# Altium schematic sheet ut_basketball_robot_mainboard_2018.SchDoc
size A3
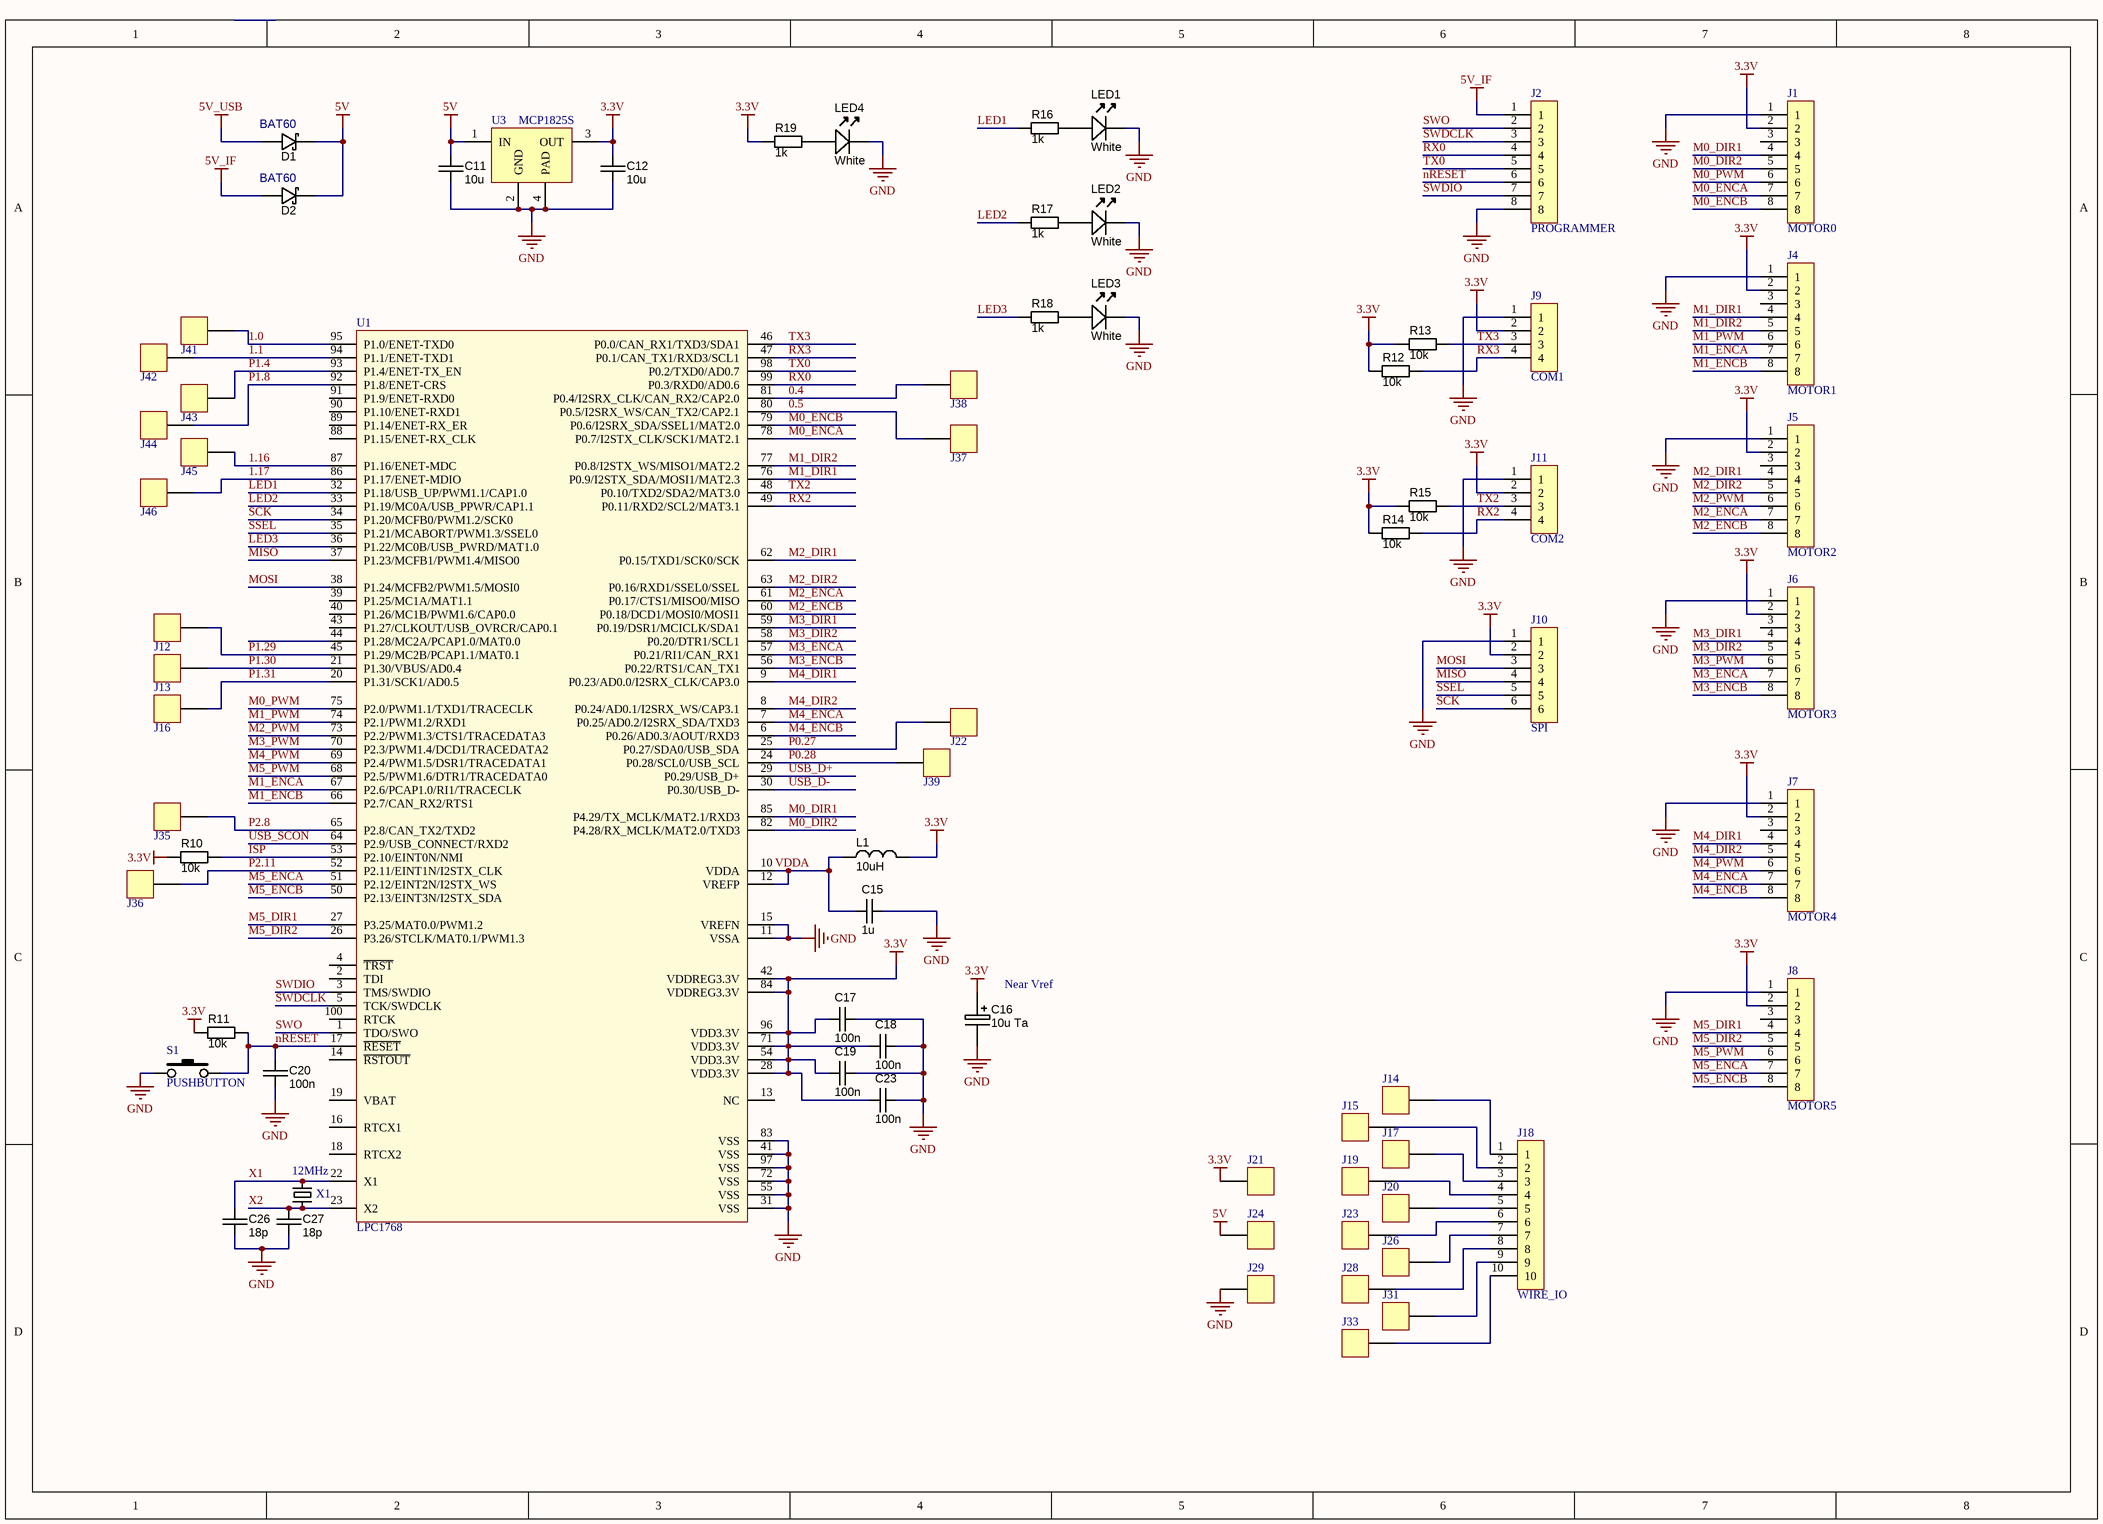
[diagram p0: ut_basketball_robot_mainboard_2018.SchDoc]

## Parts
C11  10u  [CAPC3216X180N]
C12  10u  [CAPC3216X180N]
C15  1u  [CAPC1608X90N]
C16  10u Ta  [CAPMP3528X210N]
C17  100n  [CAPC1608X90N]
C18  100n  [CAPC1608X90N]
C19  100n  [CAPC1608X90N]
C20  100n  [CAPC1608X90N]
C23  100n  [CAPC1608X90N]
C26  18p  [CAPC1608X90N]
C27  18p  [CAPC1608X90N]
D1  BAT60  [SOD323]
D2  BAT60  [SOD323]
J1  MOTOR0  [MICRO-MATCH-FOB-08]
J2  PROGRAMMER  [MICRO-MATCH-FOB-08]
J4  MOTOR1  [MICRO-MATCH-FOB-08]
J5  MOTOR2  [MICRO-MATCH-FOB-08]
J6  MOTOR3  [MICRO-MATCH-FOB-08]
J7  MOTOR4  [MICRO-MATCH-FOB-08]
J8  MOTOR5  [MICRO-MATCH-FOB-08]
J9  COM1  [MICRO-MATCH-FOB-04]
J10  SPI  [MICRO-MATCH-FOB-06]
J11  COM2  [MICRO-MATCH-FOB-04]
J12  HEADER-1  [PAD-1020]  (value not drawn)
J13  HEADER-1  [PAD-1020]  (value not drawn)
J14  HEADER-1  [PAD-1020]  (value not drawn)
J15  HEADER-1  [PAD-1020]  (value not drawn)
J16  HEADER-1  [PAD-1020]  (value not drawn)
J17  HEADER-1  [PAD-1020]  (value not drawn)
J18  WIRE_IO  [MICRO-MATCH-FOB-10]
J19  HEADER-1  [PAD-1020]  (value not drawn)
J20  HEADER-1  [PAD-1020]  (value not drawn)
J21  HEADER-1  [PAD-1020]  (value not drawn)
J22  HEADER-1  [PAD-1020]  (value not drawn)
J23  HEADER-1  [PAD-1020]  (value not drawn)
J24  HEADER-1  [PAD-1020]  (value not drawn)
J26  HEADER-1  [PAD-1020]  (value not drawn)
J28  HEADER-1  [PAD-1020]  (value not drawn)
J29  HEADER-1  [PAD-1020]  (value not drawn)
J31  HEADER-1  [PAD-1020]  (value not drawn)
J33  HEADER-1  [PAD-1020]  (value not drawn)
J35  HEADER-1  [PAD-1020]  (value not drawn)
J36  HEADER-1  [PAD-1020]  (value not drawn)
J37  HEADER-1  [PAD-1020]  (value not drawn)
J38  HEADER-1  [PAD-1020]  (value not drawn)
J39  HEADER-1  [PAD-1020]  (value not drawn)
J41  HEADER-1  [PAD-1020]  (value not drawn)
J42  HEADER-1  [PAD-1020]  (value not drawn)
J43  HEADER-1  [PAD-1020]  (value not drawn)
J44  HEADER-1  [PAD-1020]  (value not drawn)
J45  HEADER-1  [PAD-1020]  (value not drawn)
J46  HEADER-1  [PAD-1020]  (value not drawn)
L1  10uH  [INDC1608N]
LED1  White  [LED-0603-WHITE]
LED2  White  [LED-0603-WHITE]
LED3  White  [LED-0603-WHITE]
LED4  White  [LED-0603-WHITE]
R10  10k  [RESC1608X55N]
R11  10k  [RESC1608X55N]
R12  10k  [RESC1608X55N]
R13  10k  [RESC1608X55N]
R14  10k  [RESC1608X55N]
R15  10k  [RESC1608X55N]
R16  1k  [RESC1608X55N]
R17  1k  [RESC1608X55N]
R18  1k  [RESC1608X55N]
R19  1k  [RESC1608X55N]
S1  PUSHBUTTON  [KMR421NGLFS]
U1  LPC1768  [LQFP100]
U3  MCP1825S  [SOT230P700X180-4N]
X1  12MHz  [XTAL-3.2x2.5]

## Nets
3.3V: C12.1 C16.1 C17.1 C18.1 C19.1 C23.1 J1.2 J4.2 J5.2 J6.2 J7.2 J8.2 J9.2 J10.2 J11.2 J21.1 L1.2 R10.2 R11.1 R12.1 R13.1 R14.1 R15.1 R19.2 U1.28(VDD3.3V) U1.42(VDDREG3.3V) U1.54(VDD3.3V) U1.71(VDD3.3V) U1.84(VDDREG3.3V) U1.96(VDD3.3V) U3.3(OUT)
5V: C11.1 D1.K D2.K J24.1 U3.1(IN)
5V_IF: D2.A J2.1
5V_USB: D1.A
GND: C11.2 C12.2 C15.2 C16.2 C17.2 C18.2 C19.2 C20.2 C23.2 C26.2 C27.2 J1.1 J2.8 J4.1 J5.1 J6.1 J7.1 J8.1 J9.1 J10.1 J11.1 J29.1 LED1.K LED2.K LED3.K LED4.K S1.1 U1.11(VSSA) U1.15(VREFN) U1.31(VSS) U1.41(VSS) U1.55(VSS) U1.72(VSS) U1.83(VSS) U1.97(VSS) U3.2(GND) U3.4(PAD)
0.4: J38.1 U1.81(P0.4/I2SRX_CLK/CAN_RX2/CAP2.0)
0.5: J37.1 U1.80(P0.5/I2SRX_WS/CAN_TX2/CAP2.1)
1.0: J41.1 U1.95(P1.0/ENET-TXD0)
1.1: J42.1 U1.94(P1.1/ENET-TXD1)
1.16: J45.1 U1.87(P1.16/ENET-MDC)
1.17: J46.1 U1.86(P1.17/ENET-MDIO)
ISP: R10.1 U1.53(P2.10/EINT0N/NMI)
LED1: R16.2 U1.32(P1.18/USB_UP/PWM1.1/CAP1.0)
LED2: R17.2 U1.33(P1.19/MC0A/USB_PPWR/CAP1.1)
LED3: R18.2 U1.36(P1.22/MC0B/USB_PWRD/MAT1.0)
M0_DIR1: J1.4 U1.85(P4.29/TX_MCLK/MAT2.1/RXD3)
M0_DIR2: J1.5 U1.82(P4.28/RX_MCLK/MAT2.0/TXD3)
M0_ENCA: J1.7 U1.78(P0.7/I2STX_CLK/SCK1/MAT2.1)
M0_ENCB: J1.8 U1.79(P0.6/I2SRX_SDA/SSEL1/MAT2.0)
M0_PWM: J1.6 U1.75(P2.0/PWM1.1/TXD1/TRACECLK)
M1_DIR1: J4.4 U1.76(P0.9/I2STX_SDA/MOSI1/MAT2.3)
M1_DIR2: J4.5 U1.77(P0.8/I2STX_WS/MISO1/MAT2.2)
M1_ENCA: J4.7 U1.67(P2.6/PCAP1.0/RI1/TRACECLK)
M1_ENCB: J4.8 U1.66(P2.7/CAN_RX2/RTS1)
M1_PWM: J4.6 U1.74(P2.1/PWM1.2/RXD1)
M2_DIR1: J5.4 U1.62(P0.15/TXD1/SCK0/SCK)
M2_DIR2: J5.5 U1.63(P0.16/RXD1/SSEL0/SSEL)
M2_ENCA: J5.7 U1.61(P0.17/CTS1/MISO0/MISO)
M2_ENCB: J5.8 U1.60(P0.18/DCD1/MOSI0/MOSI1)
M2_PWM: J5.6 U1.73(P2.2/PWM1.3/CTS1/TRACEDATA3)
M3_DIR1: J6.4 U1.59(P0.19/DSR1/MCICLK/SDA1)
M3_DIR2: J6.5 U1.58(P0.20/DTR1/SCL1)
M3_ENCA: J6.7 U1.57(P0.21/RI1/CAN_RX1)
M3_ENCB: J6.8 U1.56(P0.22/RTS1/CAN_TX1)
M3_PWM: J6.6 U1.70(P2.3/PWM1.4/DCD1/TRACEDATA2)
M4_DIR1: J7.4 U1.9(P0.23/AD0.0/I2SRX_CLK/CAP3.0)
M4_DIR2: J7.5 U1.8(P0.24/AD0.1/I2SRX_WS/CAP3.1)
M4_ENCA: J7.7 U1.7(P0.25/AD0.2/I2SRX_SDA/TXD3)
M4_ENCB: J7.8 U1.6(P0.26/AD0.3/AOUT/RXD3)
M4_PWM: J7.6 U1.69(P2.4/PWM1.5/DSR1/TRACEDATA1)
M5_DIR1: J8.4 U1.27(P3.25/MAT0.0/PWM1.2)
M5_DIR2: J8.5 U1.26(P3.26/STCLK/MAT0.1/PWM1.3)
M5_ENCA: J8.7 U1.51(P2.12/EINT2N/I2STX_WS)
M5_ENCB: J8.8 U1.50(P2.13/EINT3N/I2STX_SDA)
M5_PWM: J8.6 U1.68(P2.5/PWM1.6/DTR1/TRACEDATA0)
MISO: J10.4 U1.37(P1.23/MCFB1/PWM1.4/MISO0)
MOSI: J10.3 U1.38(P1.24/MCFB2/PWM1.5/MOSI0)
nRESET: C20.1 J2.6 R11.2 S1.2 U1.17(~{RESET})
P0.27: J22.1 U1.25(P0.27/SDA0/USB_SDA)
P0.28: J39.1 U1.24(P0.28/SCL0/USB_SCL)
P1.4: J43.1 U1.93(P1.4/ENET-TX_EN)
P1.8: J44.1 U1.92(P1.8/ENET-CRS)
P1.29: J12.1 U1.45(P1.29/MC2B/PCAP1.1/MAT0.1)
P1.30: J13.1 U1.21(P1.30/VBUS/AD0.4)
P1.31: J16.1 U1.20(P1.31/SCK1/AD0.5)
P2.8: J35.1 U1.65(P2.8/CAN_TX2/TXD2)
P2.11: J36.1 U1.52(P2.11/EINT1N/I2STX_CLK)
RX0: J2.4 U1.99(P0.3/RXD0/AD0.6)
RX2: J11.4 R14.2 U1.49(P0.11/RXD2/SCL2/MAT3.1)
RX3: J9.4 R12.2 U1.47(P0.1/CAN_TX1/RXD3/SCL1)
SCK: J10.6 U1.34(P1.20/MCFB0/PWM1.2/SCK0)
SSEL: J10.5 U1.35(P1.21/MCABORT/PWM1.3/SSEL0)
SWDCLK: J2.3 U1.5(TCK/SWDCLK)
SWDIO: J2.7 U1.3(TMS/SWDIO)
SWO: J2.2 U1.1(TDO/SWO)
TX0: J2.5 U1.98(P0.2/TXD0/AD0.7)
TX2: J11.3 R15.2 U1.48(P0.10/TXD2/SDA2/MAT3.0)
TX3: J9.3 R13.2 U1.46(P0.0/CAN_RX1/TXD3/SDA1)
USB_D+: U1.29(P0.29/USB_D+)
USB_D-: U1.30(P0.30/USB_D-)
USB_SCON: U1.64(P2.9/USB_CONNECT/RXD2)
VDDA: C15.1 L1.1 U1.10(VDDA) U1.12(VREFP)
X1: C26.1 U1.22(X1) X1.3
X2: C27.1 U1.23(X2) X1.1
NetJ14_1: J14.1 J18.1
NetJ15_1: J15.1 J18.2
NetJ17_1: J17.1 J18.3
NetJ18_4: J18.4 J19.1
NetJ18_5: J18.5 J20.1
NetJ18_6: J18.6 J23.1
NetJ18_7: J18.7 J26.1
NetJ18_8: J18.8 J28.1
NetJ18_9: J18.9 J31.1
NetJ18_10: J18.10 J33.1
NetLED1_A: LED1.A R16.1
NetLED2_A: LED2.A R17.1
NetLED3_A: LED3.A R18.1
NetLED4_A: LED4.A R19.1

Not connected (* = marked no-connect by the designer): J1 3; J4 3; J5 3; J6 3; J7 3; J8 3; U1 2(TDI) 4(~{TRST}) 13(NC) 14(~{RSTOUT}) 16(RTCX1) 18(RTCX2) 19(VBAT) 39(P1.25/MC1A/MAT1.1) 40(P1.26/MC1B/PWM1.6/CAP0.0) 43(P1.27/CLKOUT/USB_OVRCR/CAP0.1) 44(P1.28/MC2A/PCAP1.0/MAT0.0) 88(P1.15/ENET-RX_CLK) 89(P1.14/ENET-RX_ER) 90(P1.10/ENET-RXD1) 91(P1.9/ENET-RXD0) 100(RTCK)

## Notes on the sheet
- (near C16) Near Vref

## Library data of the parts
C11 C12 = CAPC_10u_1206_10V: Capacitor SMD Cer 10uF 10% 10V X5R 1206; Manufacturer 1: KEMET; Manufacturer Part Number 1: C1206C106K8PACTU; Ratings: 10V; X5R; Material: ceramic; Value: 10µ; SCDType: undef; Package / Case: 1206 (3216 metric); Tolerance: ±10%; Supplier 1: Digi-Key; Supplier Part Number 1: C1206C106K8PACTU-ND
C15 C17-C20 C23 = CAPC_18p_0603_100V: Capacitor SMD Cer 18pF 2% 100V NP0 0603; Manufacturer 1: AVX Corporation; Manufacturer Part Number 1: 06031A180GAT2A; Ratings: 100V; NP0; Value: 18p; SCDType: spec; Tolerance: ±2%; Operating Temperature: -55°C ~ 125°C; Package / Case: 0603 (1608 Metric); Supplier 1: Digi-Key; Supplier Part Number 1: 478-6025-1-ND; Size / Dimension: 0.063" L x 0.032" W (1.60mm x 0.81mm); Thickness (Max): 0.035" (0.90mm); ComponentLink1URL: http://www.avx.com/docs/Catalogs/ccog.pdf; ComponentLink1Description: http://www.avx.com/docs/Catalogs/ccog.pdf
C16 = CAPT_47u_1210_6V3: Capacitor SMD Tantalum 47uF 20% 6.3V 1210; Manufacturer 1: AVX Corporation; Manufacturer Part Number 1: TCJB476M006R0070; Manufacturer Size Code: B; Voltage - Rated: 6V3; ESR (Equivalent Series Resistance): 70.0 mOhm; Type: Molded; Value: 47µ; SCDType: spec; Package / Case: 1210 (3528 Metric); Tolerance: ±20%; Material: Tantalum; Supplier 1: Digi-Key; Supplier Part Number 1: 478-3139-1-ND; Operating Temperature: -55°C ~ 125°C; Size / Dimension: 0.138" L x 0.110" W (3.50mm x 2.80mm); Height - Seated (Max): 0.083" (2.10mm); ComponentLink1URL: http://www.avx.com/docs/Catalogs/tcj.pdf; ComponentLink1Description: http://www.avx.com/docs/Catalogs/tcj.pdf; Ratings: 6.3V
C26 C27 = CAPC_18p_0603_100V: Capacitor SMD Cer 18pF 2% 100V NP0 0603; Manufacturer 1: AVX Corporation; Manufacturer Part Number 1: 06031A180GAT2A; Ratings: 100V; NP0; SCDType: spec; Tolerance: ±2%; Operating Temperature: -55°C ~ 125°C; Package / Case: 0603 (1608 Metric); Supplier 1: Digi-Key; Supplier Part Number 1: 478-6025-1-ND; Size / Dimension: 0.063" L x 0.032" W (1.60mm x 0.81mm); Thickness (Max): 0.035" (0.90mm); ComponentLink1URL: http://www.avx.com/docs/Catalogs/ccog.pdf; ComponentLink1Description: http://www.avx.com/docs/Catalogs/ccog.pdf; Value: 18p
D1 D2 = DIODE_SCHOTTKY_SS0520: Diode Schottky SMD 20V 0.5A SOD123; Manufacturer 1: Fairchild Semiconductor; Manufacturer Part Number 1: MBR0520L; Material: Si; Ratings: 20V; 0.5A; SCDType: source; Manufacturer 4: DC Components Co; Package / Case: SOD-123; Supplier 1: Digi-Key; Supplier Part Number 1: MBR0520LCT-ND; Supplier 2: Digi-Key; Supplier Part Number 2: MBR0520LT1GOSCT-ND; Manufacturer 2: ON Semiconductor; Manufacturer Part Number 2: MBR0520LT1G; ComponentLink1URL: http://www.fairchildsemi.com/ds/MB/MBR0520L.pdf; ComponentLink1Description: http://www.fairchildsemi.com/ds/MB/MBR0520L.pdf; ComponentLink2URL: http://www.onsemi.com/pub_link/Collateral/MBR0520LT1-D.PDF; ComponentLink2Description: http://www.onsemi.com/pub_link/Collateral/MBR0520LT1-D.PDF; Supplier 3: Digi-Key; Supplier Part Number 3: B0520LW-FDICT-ND; ComponentLink3URL: http://www.diodes.com/datasheets/ds30051.pdf; ComponentLink3Description: http://www.diodes.com/datasheets/ds30051.pdf; Manufacturer 3: Diodes Inc; Manufacturer Part Number 3: B0520LW-7-F; Manufacturer Part Number 4: SS0520
J1 J2 J4-J8 = HEADER-8
J9 J11 = HEADER-4
J10 = HEADER-6
J18 = HEADER-10
L1 = FERRITE_120R-100MHz_0603: Ferrite bead 120 Ohm at 100 MHz 2A 0603 SMD; Manufacturer 1: Murata Electronics North America; Manufacturer Part Number 1: BLM18PG121SN1D; Current: 900mA; DC Resistance (DCR): 172.9 mOhm Max; Frequency - Self Resonant: 23MHz; Frequency - Test: 100kHz; Impedance @ Frequency: 120 Ohm @ 100MHz; Filter Type: Differential Mode - Single; Number of Lines: 1; Ratings: 2 A; 50 mO DC; Value: 120R @ 100 MHz; SCDType: source; Current - Saturation: 900mA; Current - Temperature Rise: 900mA; Applications: Power Supplies; Package / Case: 1210 (3225 Metric); Operating Temperature: -40°C ~ 105°C; ComponentLink1URL: http://www.yuden.co.jp/ut/product/pdf/wound02_e.pdf; ComponentLink1Description: http://www.yuden.co.jp/ut/product/pdf/wound02_e.pdf; Supplier 1: Digi-Key; Supplier Part Number 1: 490-1037-1-ND; Current Rating: 2A; Mounting Type: Surface Mount; Height (Max): 0.037" (0.95mm); Size / Dimension: 0.063" L x 0.031" W (1.60mm x 0.80mm); ComponentLink2URL: http://search.murata.co.jp/Ceramy/image/img/PDF/ENG/L0110S0100BLM18P.pdf; ComponentLink2Description: http://search.murata.co.jp/Ceramy/image/img/PDF/ENG/L0110S0100BLM18P.pdf
LED1-LED4 = LED_SMD_White_0603_Bright: LED 0603 SMD Bright White 8700K; Manufacturer 1: Lite-On Inc; Manufacturer Part Number 1: LTW-C193TS5; Material: InGaN; Ratings: Ultra Bright; 8700K; Millicandela Rating: 230mcd; Voltage - Forward (Vf) Typ: 3.3V; Viewing Angle: 120°; Lens Type: Clear, Tinted; Lens Style/Size: Rectangle with Flat Top, 0.8mm x 1.1mm; Voltage - Forward (Vf) @ 10mA: 3.0V; SCDType: source; Package / Case: 0603 (1608 metric); Supplier 1: Digi-Key; Supplier Part Number 1: 160-1721-1-ND; Supplier 2: Digi-Key; Supplier Part Number 2: APT1608QWF/D-ND; Manufacturer 2: Kingbright Corp; Manufacturer Part Number 2: APT1608QWF/D; Color: White; Size / Dimension: 1.60mm L x 0.80mm W; Mounting Type: Surface Mount; Luminous Flux @ Current - Test: -; ComponentLink2URL: http://www.kingbrightusa.com/images/catalog/SPEC/APT1608QWF-D.pdf; ComponentLink2Description: http://www.kingbrightusa.com/images/catalog/SPEC/APT1608QWF-D.pdf; ComponentLink1URL: http://media.digikey.com/pdf/Data%20Sheets/Lite-On%20PDFs/LTW-C193TS5.pdf; ComponentLink1Description: http://media.digikey.com/pdf/Data%20Sheets/Lite-On%20PDFs/LTW-C193TS5.pdf
R10-R15 = RES_10K_0603_5%: Resistor SMD chip 10k Ohm 0.1W 5% 0603; Manufacturer 1: Yageo; Manufacturer Part Number 1: RC0603JR-0710KL; Ratings: 1/10 W; SCDType: spec; Package / Case: 0603 (1608 metric); Tolerance: ±5%; Material: Thick Film; Supplier 1: Digi-Key; Supplier Part Number 1: 311-10KGRCT-ND; Supplier 2: Digi-Key; Supplier Part Number 2: 541-10KGCT-ND; Manufacturer 2: Vishay Dale; Manufacturer Part Number 2: CRCW060310K0JNEA; ComponentLink2URL: http://www.vishay.com/doc?20035; ComponentLink2Description: http://www.vishay.com/doc?20035; ComponentLink1URL: http://www.yageo.com/documents/recent/PYu-RC0603_51_RoHS_L_4.pdf; ComponentLink1Description: http://www.yageo.com/documents/recent/PYu-RC0603_51_RoHS_L_4.pdf; Value: 10K
R16-R19 = RES_120R_0603_5%: Resistor SMD chip 120 Ohm 0.1W 5% 0603; Manufacturer 1: Vishay Dale; Manufacturer Part Number 1: CRCW0603120RJNEA; Ratings: 1/10 W; SCDType: spec; Value: 120R; Package / Case: 0603 (1608 metric); Tolerance: ±5%; Material: Thick Film; Supplier 1: Digi-Key; Supplier Part Number 1: 541-120GCT-ND; ComponentLink1URL: http://www.vishay.com/doc?20035; ComponentLink1Description: http://www.vishay.com/doc?20035; Supplier 2: Digi-Key; Supplier Part Number 2: 311-120GRCT-ND; Manufacturer 2: Yageo; Manufacturer Part Number 2: RC0603JR-07120RL; ComponentLink2URL: http://www.yageo.com/documents/recent/PYu-RC0603_51_RoHS_L_4.pdf; ComponentLink2Description: http://www.yageo.com/documents/recent/PYu-RC0603_51_RoHS_L_4.pdf
U3 = MIC5239
X1 = XTAL-3.2X2.5